# EAGLE design project (EAGLE 7.7.0)
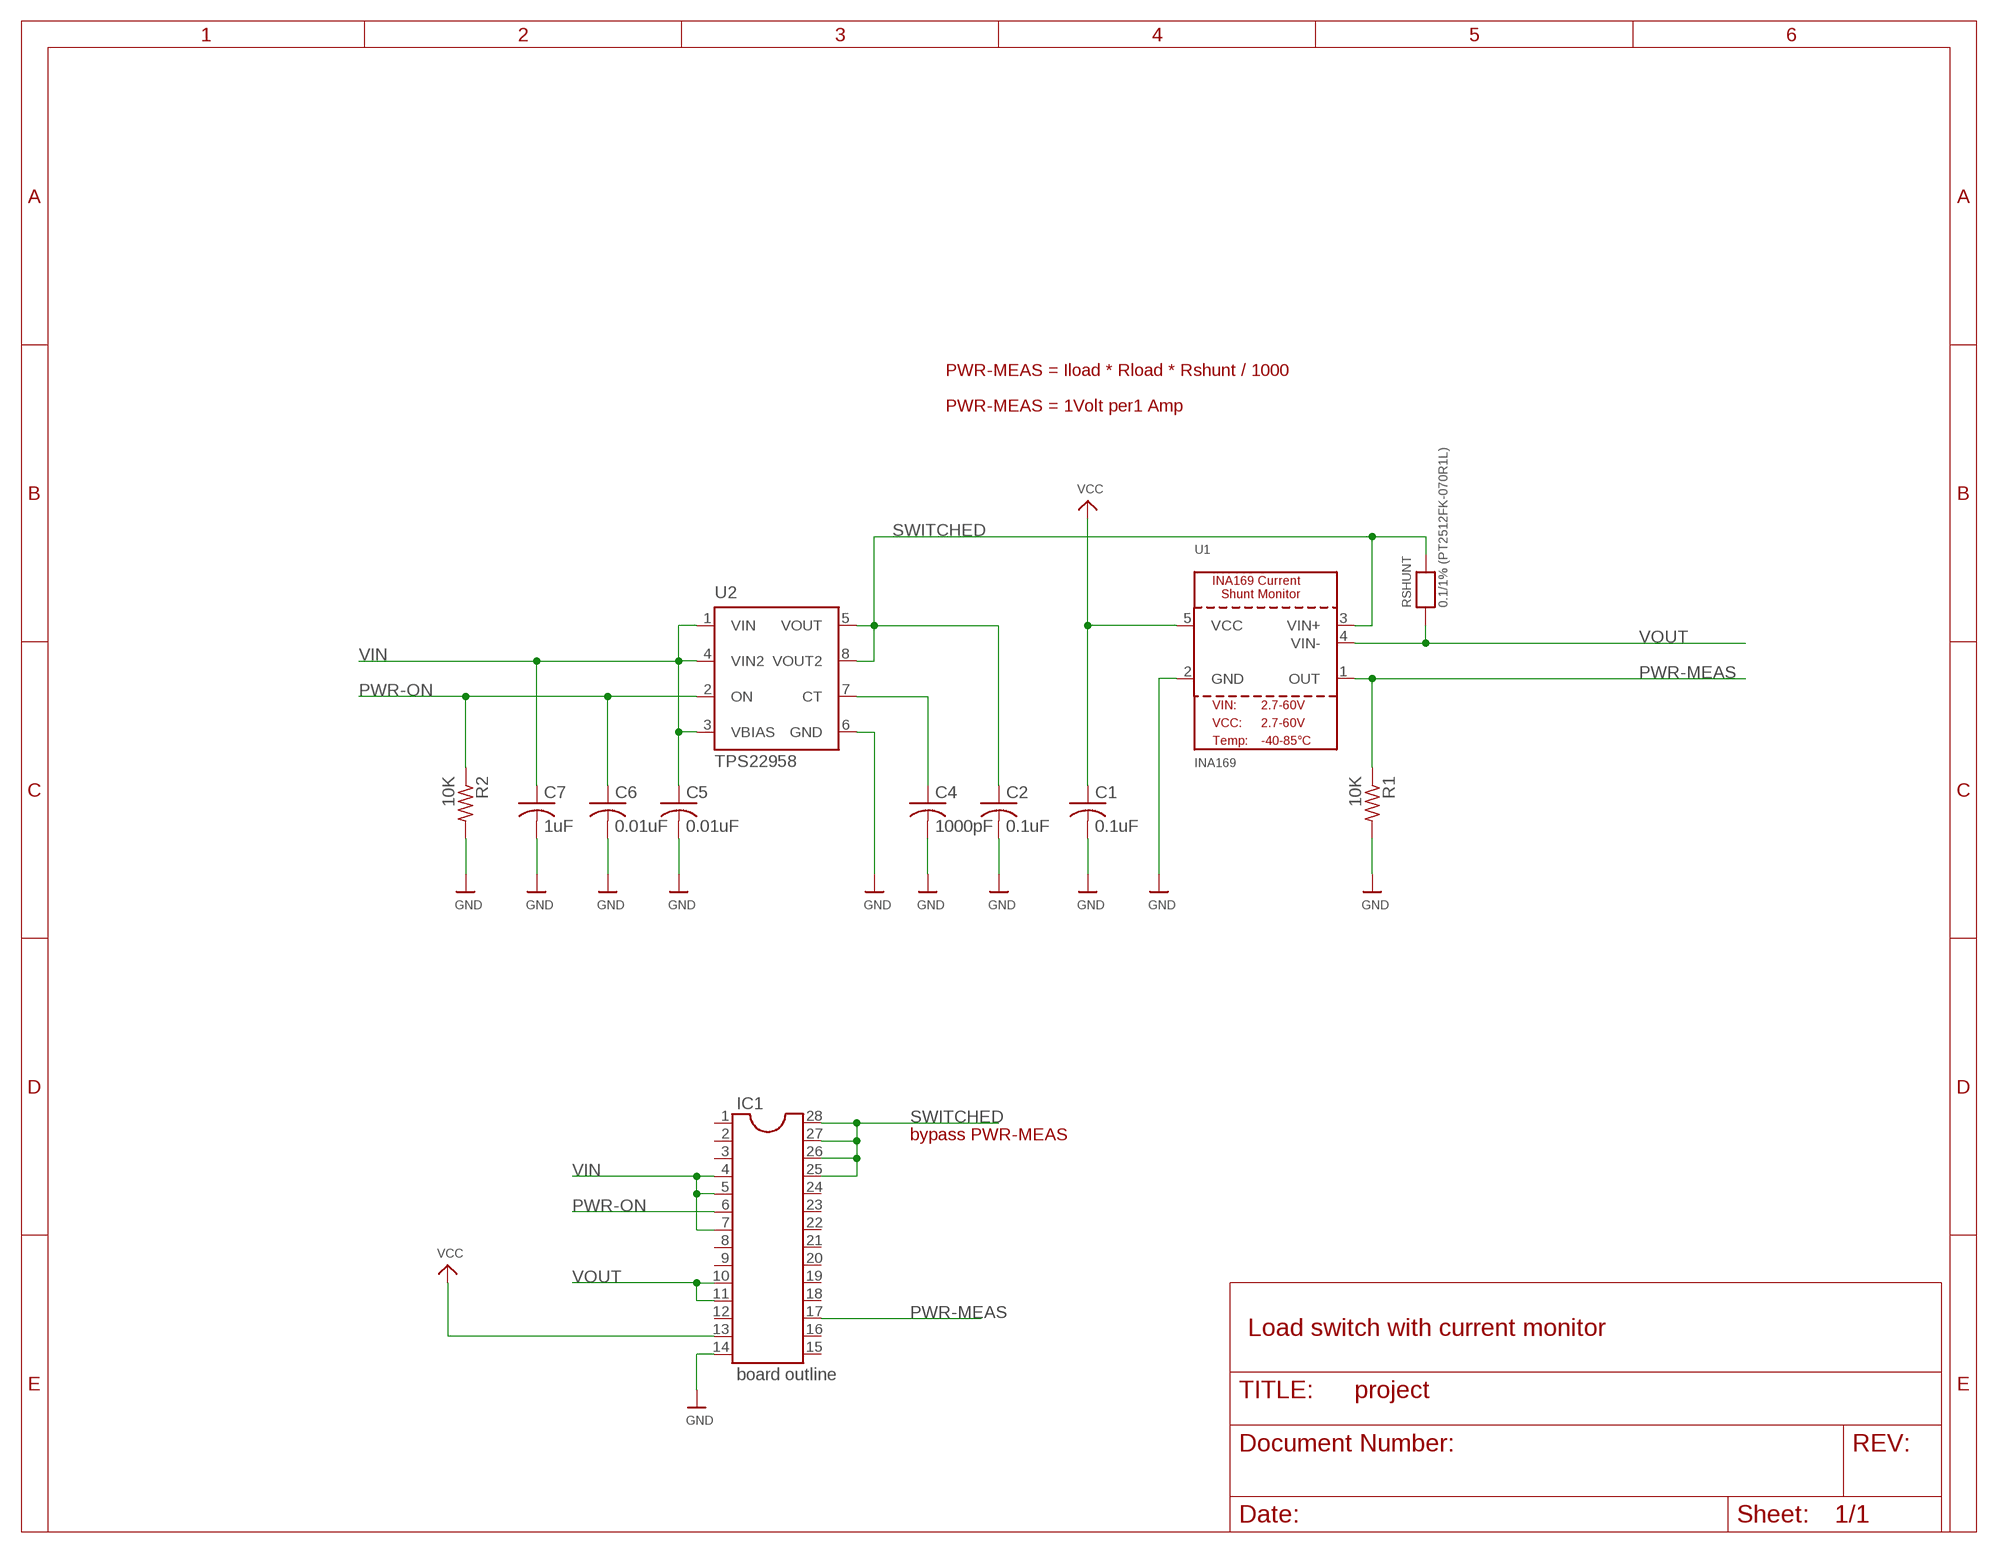
[diagram p0: schematic, sheet 1]

## Parts
C1  0.1uF  C-USC1206K  [C1206K]
C2  0.1uF  C-USC1206K  [C1206K]
C4  1000pF  C-USC1206K  [C1206K]
C5  0.01uF  C-USC1206K  [C1206K]
C6  0.01uF  C-USC1206K  [C1206K]
C7  1uF  C-USC1206K  [C1206K]
IC1  board outline  DIL28  [DIL28-6]
R1  10K  R-US_M1206  [M1206]
R2  10K  R-US_M1206  [M1206]
RSHUNT  0.1/1% (PT2512FK-070R1L)  RESISTOR2512  [2512]
U1  INA169  [SOT23-5]
U2  TPS22958  [S-PDSO-G08]

## Nets
CT: C4.1 U2.7(CT)
GND: C1.2 C2.2 C4.2 C5.2 C6.2 C7.2 IC1.14 R1.2 R2.2 U1.2(GND) U2.6(GND)
PWR-MEAS: IC1.17 R1.1 U1.1(OUT)
PWR-ON: C6.1 IC1.6 R2.1 U2.2(ON)
SWITCHED: C2.1 IC1.25 IC1.26 IC1.27 IC1.28 RSHUNT.2 U1.3(VIN+) U2.5(VOUT) U2.8(VOUT2)
VCC: C1.1 IC1.13 U1.5(VCC)
VIN: C5.1 C7.1 IC1.4 IC1.5 IC1.7 U2.1(VIN) U2.3(VBIAS) U2.4(VIN2)
VOUT: IC1.10 IC1.11 RSHUNT.1 U1.4(VIN-)
Unconnected: IC1.1 IC1.2 IC1.3 IC1.8 IC1.9 IC1.12 IC1.15 IC1.16 IC1.18 IC1.19 IC1.20 IC1.21 IC1.22 IC1.23 IC1.24

## Notes on the sheet
- PWR-MEAS = Iload * Rload * Rshunt / 1000
- PWR-MEAS = 1Volt per1 Amp
- bypass PWR-MEAS
- Load switch with current monitor

## Library data of the parts
C1 C2 C4-C7 = resistor:C-US: CAPACITOR, American symbol
IC1 = ic-package:DIL28: Dual In Line
R1 R2 = resistor:R-US_: RESISTOR, American symbol
RSHUNT = microbuilder:RESISTOR: Resistors For new designs, use the packages preceded by an '_' character since they are more reliable: The following footprints should be used on most boards: _0402 - Standard footprint for regular board layouts _0603 - Standard footprint for regular board layouts _0805 - Standard footprint for regular board layouts For extremely tight-pitch boards where space is at a premium, the following 'micro-pitch' footprints can be used (smaller pads, no silkscreen outline, etc.): _0402MP - Micro-pitch footprint for very dense/compact boards _0603MP - Micro-pitch footprint for very dense/compact boards _0805MP - Micro-pitch footprint for very dense/compact boards
U1 = microbuilder:INA169: INA169 - High-Side Measurement Current Shunt Monitor The device converts a differential input voltage to a current output. This current is converted back to a voltage with an external load resistor that sets any gain from 1 to over 100.
U2 = worlickwerx:TPS22958: High side load switch

## Board
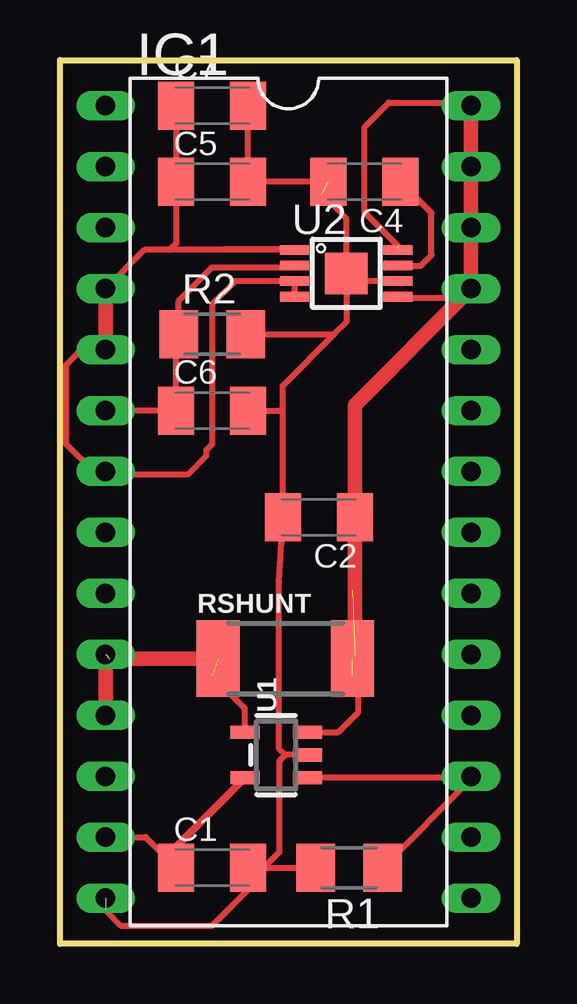
[diagram p1: board, top side]
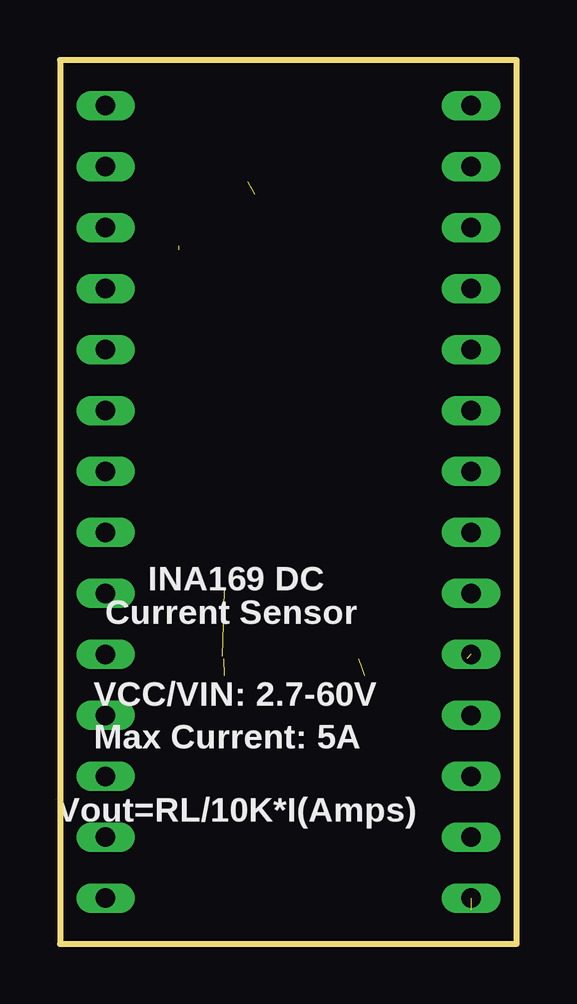
[diagram p2: board, bottom side, seen from below]

Size 19.05 x 36.83 mm. Coordinates in mm from the lower left corner, seen from the top.
Outline: 0,36.83 0,0 19.05,0 19.05,36.83 0,36.83
Copper layers (1*16): Top 0.035mm / dielectric 1.5mm / Bottom 0.035mm
Design rules "default": minimum track width 8mil, minimum drill 0.4mm, track to track 8mil, track to pad 8mil, pad to pad 8mil, via to via 8mil, smd to smd 8mil, copper to edge 20mil, drill to drill 8mil, minimum pad ring 8mil, minimum via ring 10mil, stop-mask expansion 3mil, vias tented up to drill 20mil, thermal gap 8mil
Milling: 4 lines

### Footprints (pad centres in the part's own frame; a part is rotated, then mirrored left to right if it is on the bottom)
C1206K = smd 1.5 x 2: 1 -1.5,0; 2 1.5,0
DIL28-6 = drill 0.813 long: 1 -16.51,-7.62; 2 -13.97,-7.62; 3 -11.43,-7.62; 4 -8.89,-7.62; 5 -6.35,-7.62; 6 -3.81,-7.62; 7 -1.27,-7.62; 8 1.27,-7.62; 9 3.81,-7.62; 10 6.35,-7.62; 11 8.89,-7.62; 12 11.43,-7.62; 13 13.97,-7.62; 14 16.51,-7.62; 15 16.51,7.62; 16 13.97,7.62; 17 11.43,7.62; 18 8.89,7.62; 19 6.35,7.62; 20 3.81,7.62; 21 1.27,7.62; 22 -1.27,7.62; 23 -3.81,7.62; 24 -6.35,7.62; 25 -8.89,7.62; 26 -11.43,7.62; 27 -13.97,7.62; 28 -16.51,7.62
M1206 = smd 1.6 x 2: 1 -1.4,0; 2 1.4,0
2512 = smd 1.8 x 3.2: 1 -2.8,0; 2 2.8,0
SOT23-5 = smd 0.55 x 1.2: 1 -0.95,-1.3; 2 0,-1.3; 3 0.95,-1.3; 4 0.95,1.3; 5 -0.95,1.3
S-PDSO-G08 = smd 0.4 x 1.2: 1 -0.975,-2.157; 2 -0.325,-2.157; 3 0.325,-2.157; 4 0.975,-2.157; 5 0.975,2.157; 6 0.325,2.157; 7 -0.325,2.157; 8 -0.975,2.157 | smd 1.73 x 1.78: TH 0,0

### Placement (x,y rotation side)
C1  6.35,3.17 0 top
C2  10.79,17.78 180 top
C4  12.7,31.75 180 top
C5  6.35,31.75 0 top
C6  6.35,22.23 0 top
C7  6.35,34.92 0 top
IC1  9.53,18.41 270 top
R1  12.06,3.17 180 top
R2  6.35,25.4 0 top
RSHUNT  9.4,11.89 0 top
U1  9.02,7.87 90 top
U2  11.94,27.94 270 top

### Tracks (layer width: path | path; a pad name or v marks a point on that pad's centre or on a via)
CT
  Top 0.254: U2.7 15.06,28.27 15.49,28.7 15.49,30.46 C4.1
GND  (2 unrouted)
  Top 0.254: C4.2 C5.2 C7.2 | U1.2 9.4,7.87 | U2.6 12.77,27.61 11.94,28.45 | 11.94,28.45 11.94,30.23 10.92,31.24 | 11.94,28.45 11.94,25.91 11.43,25.4 | 1.91,1.4 2.54,0.76 6.35,0.76 7.87,2.29 7.87,2.54 | 7.87,2.54 7.87,3.15 C1.2 R1.2 | 9.4,7.87 9.14,7.62 9.14,3.81 7.87,2.54 | 9.4,7.87 9.14,8.13 9.14,15.09 C2.2 9.29,22.1 | 9.29,22.1 9.29,23.27 11.43,25.4 | C6.2 9.17,22.23 9.29,22.1 | R2.2 11.43,25.4
PWR-MEAS
  Top 0.254: U1.1 17.08,6.92 IC1.17 17.14,6.86 R1.1
PWR-ON
  Top 0.254: IC1.6 C6.1 4.85,25.3 R2.1 4.95,26.79 6.35,28.19 9.71,28.19 U2.2
SWITCHED  (3 unrouted)
  Top 0.254: U1.3 11.62,8.82 12.45,9.65 12.45,10.92 12.19,11.18 | 14.1,29.09 12.7,30.48 12.7,34.04 13.72,35.05 17.02,35.05 IC1.28 | 12.2,14.73 12.19,14.73 | U2.5 14.14,26.92 16.26,26.92 16.64,27.3 IC1.25
  Top 0.61: IC1.28 IC1.27 IC1.26 IC1.25 12.29,22.45 C2.1 12.29,11.99 RSHUNT.2
VCC
  Top 0.254: IC1.13 3.58,4.45 C1.1
  Top 0.305: U1.5 4.85,4.06 C1.1
VIN
  Top 0.254: C7.1 C5.1 4.85,29.19 4.57,28.91 | U2.4 U2.3 7.29,27.61 6.35,26.67 6.35,20.83 6.1,20.57 6.1,20.32 5.33,19.56 2.03,19.56 IC1.7 1.4,19.68 0.25,20.83 0.25,24.13 1.02,24.89 1.78,24.89 IC1.5 | 6.86,28.96 9.74,28.96 U2.1 4.57,28.91 | 4.57,28.91 3.52,28.91 IC1.4
  Top 0.61: IC1.4 IC1.5
VOUT  (2 unrouted)
  Top 0.254: U1.4 7.72,9.81 6.35,11.18
  Top 0.61: RSHUNT.1 2.08,11.89 | IC1.10 IC1.11

### Text on the board
bPlace: INA169 DC | Current Sensor | VCC/VIN: 2.7-60V | Max Current: 5A | Vout=RL/10K*I(Amps)